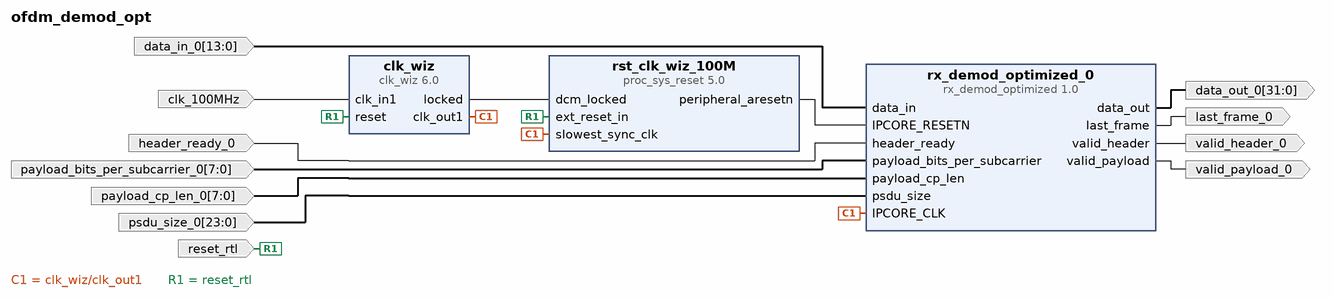
[diagram p0: block diagram of the top level]
# Vivado block design ofdm_demod_opt, xc7z010clg400-1, Vivado 2023.2
create_bd_design ofdm_demod_opt

create_bd_port -dir I -type clk clk_100MHz
set_property -dict {CONFIG.FREQ_HZ 100000000} [get_bd_ports clk_100MHz]
create_bd_port -dir I -type rst reset_rtl
set_property -dict {CONFIG.POLARITY ACTIVE_HIGH} [get_bd_ports reset_rtl]
create_bd_port -dir I -from 13 -to 0 data_in_0
create_bd_port -dir O -from 31 -to 0 data_out_0
create_bd_port -dir I header_ready_0
create_bd_port -dir O last_frame_0
create_bd_port -dir I -from 7 -to 0 payload_bits_per_subcarrier_0
create_bd_port -dir I -from 7 -to 0 payload_cp_len_0
create_bd_port -dir I -from 23 -to 0 psdu_size_0
create_bd_port -dir O valid_header_0
create_bd_port -dir O valid_payload_0

create_bd_cell -type ip -vlnv user.org:ip:rx_demod_optimized:1.0 rx_demod_optimized_0
create_bd_cell -type ip -vlnv xilinx.com:ip:clk_wiz:6.0 clk_wiz
create_bd_cell -type ip -vlnv xilinx.com:ip:proc_sys_reset:5.0 rst_clk_wiz_100M

# ---- connections ----

connect_bd_net [get_bd_ports clk_100MHz] [get_bd_pins clk_wiz/clk_in1]
connect_bd_net [get_bd_pins clk_wiz/clk_out1] [get_bd_pins rst_clk_wiz_100M/slowest_sync_clk] [get_bd_pins rx_demod_optimized_0/IPCORE_CLK]
connect_bd_net [get_bd_pins clk_wiz/locked] [get_bd_pins rst_clk_wiz_100M/dcm_locked]
connect_bd_net -net data_in_0_1 [get_bd_ports data_in_0] [get_bd_pins rx_demod_optimized_0/data_in]
connect_bd_net -net header_ready_0_1 [get_bd_ports header_ready_0] [get_bd_pins rx_demod_optimized_0/header_ready]
connect_bd_net -net payload_bits_per_subcarrier_0_1 [get_bd_ports payload_bits_per_subcarrier_0] \
  [get_bd_pins rx_demod_optimized_0/payload_bits_per_subcarrier]
connect_bd_net -net payload_cp_len_0_1 [get_bd_ports payload_cp_len_0] [get_bd_pins rx_demod_optimized_0/payload_cp_len]
connect_bd_net -net psdu_size_0_1 [get_bd_ports psdu_size_0] [get_bd_pins rx_demod_optimized_0/psdu_size]
connect_bd_net [get_bd_ports reset_rtl] [get_bd_pins clk_wiz/reset] [get_bd_pins rst_clk_wiz_100M/ext_reset_in]
connect_bd_net [get_bd_pins rst_clk_wiz_100M/peripheral_aresetn] [get_bd_pins rx_demod_optimized_0/IPCORE_RESETN]
connect_bd_net [get_bd_pins rx_demod_optimized_0/data_out] [get_bd_ports data_out_0]
connect_bd_net [get_bd_pins rx_demod_optimized_0/last_frame] [get_bd_ports last_frame_0]
connect_bd_net [get_bd_pins rx_demod_optimized_0/valid_header] [get_bd_ports valid_header_0]
connect_bd_net [get_bd_pins rx_demod_optimized_0/valid_payload] [get_bd_ports valid_payload_0]

validate_bd_design
save_bd_design
